# Altium schematic sheet uc2B.SchDoc: Microcontroller 2 (Part B)
size A4; Author: Marcel Hellwig; Organization: Hamburg Bit-Bots; Address1: Vogt-Kölln-Str. 30; Address2: 22527 Hamburg; Address3: Germany; Address4: www.bit-bots.de; DocumentNumber: 8; Revision: A; SheetNumber: 8; SheetTotal: 16; EMail: info@bit-bots.de
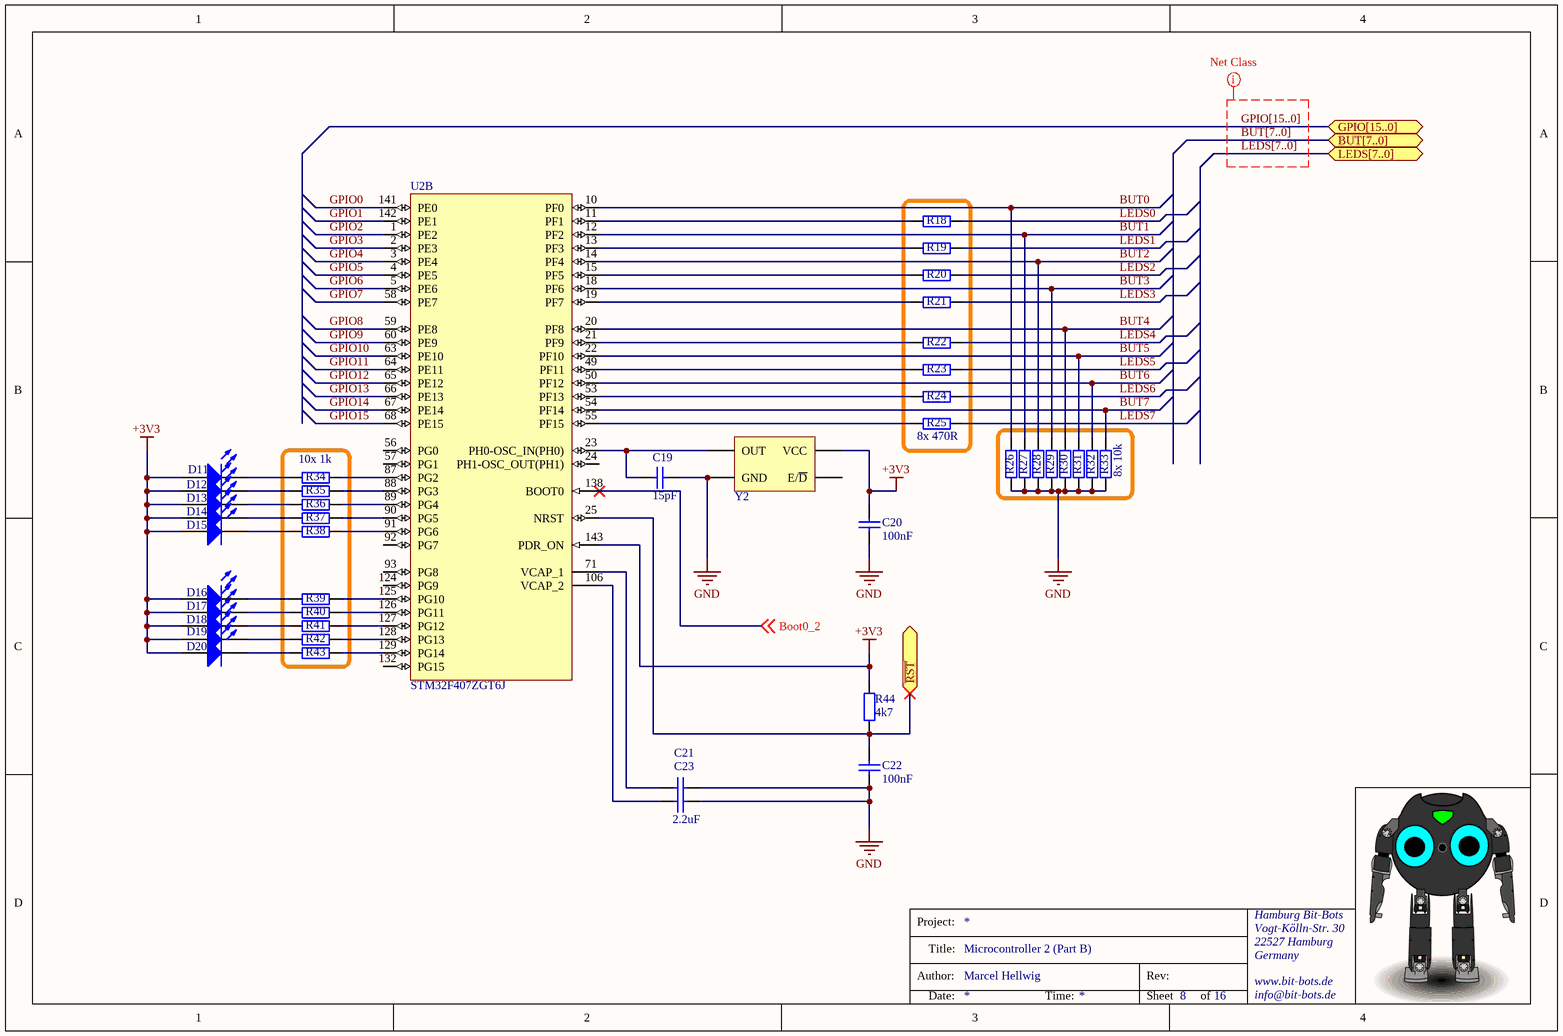
[diagram p0: uc2B.SchDoc]

## Parts
C19  15pF  [C2012]
C20  100nF  [C2012]
C21  2.2uF  [C2012]  (value not drawn)
C22  100nF  [C2012]
C23  2.2uF  [C2012]
D11  Green  [MLCC2]  (value not drawn)
D12  Green  [MLCC2]  (value not drawn)
D13  Green  [MLCC2]  (value not drawn)
D14  Green  [MLCC2]  (value not drawn)
D15  Green  [MLCC2]  (value not drawn)
D16  Green  [MLCC2]  (value not drawn)
D17  Green  [MLCC2]  (value not drawn)
D18  Green  [MLCC2]  (value not drawn)
D19  Green  [MLCC2]  (value not drawn)
D20  Green  [MLCC2]  (value not drawn)
R18  470R  [R2012]  (value not drawn)
R19  470R  [R2012]  (value not drawn)
R20  470R  [R2012]  (value not drawn)
R21  470R  [R2012]  (value not drawn)
R22  470R  [R2012]  (value not drawn)
R23  470R  [R2012]  (value not drawn)
R24  470R  [R2012]  (value not drawn)
R25  470R  [R2012]  (value not drawn)
R26  10k  [R2012]  (value not drawn)
R27  10k  [R2012]  (value not drawn)
R28  10k  [R2012]  (value not drawn)
R29  10k  [R2012]  (value not drawn)
R30  10k  [R2012]  (value not drawn)
R31  10k  [R2012]  (value not drawn)
R32  10k  [R2012]  (value not drawn)
R33  10k  [R2012]  (value not drawn)
R34  1k  [R2012]  (value not drawn)
R35  1k  [R2012]  (value not drawn)
R36  1k  [R2012]  (value not drawn)
R37  1k  [R2012]  (value not drawn)
R38  1k  [R2012]  (value not drawn)
R39  1k  [R2012]  (value not drawn)
R40  1k  [R2012]  (value not drawn)
R41  1k  [R2012]  (value not drawn)
R42  1k  [R2012]  (value not drawn)
R43  1k  [R2012]  (value not drawn)
R44  4k7  [R2012]
U2  STM32F407ZGT6J  [STM-LQFP144_M]  (part B of 3)
Y2  FXO-HC736R-16  [FXO-HC73]  (value not drawn)

## Blocks framed on the sheet
8x 470R: R18-R25
10x 1k: R34-R43
8x 10k: R26-R33

## Ports
BUT[7..0] (bidir), GPIO[15..0] (bidir), LEDS[7..0] (bidir), ~{RST}

## Nets
+3V3: C20.1 D11.1(A) D12.1(A) D13.1(A) D14.1(A) D15.1(A) D16.1(A) D17.1(A) D18.1(A) D19.1(A) D20.1(A) R44.1 U2.143(PDR_ON) Y2.4(VCC)
GND: C19.1 C20.2 C21.2 C22.1 C23.2 R26.2 R27.2 R28.2 R29.2 R30.2 R31.2 R32.2 R33.2 Y2.2(GND)
~{RST}: C22.2 R44.2 U2.25(NRST) ; port ~{RST}
Boot0_2: U2.138(BOOT0) ; off-sheet Boot0_2
BUT0: R26.1 U2.10(PF0)
BUT1: R27.1 U2.12(PF2)
BUT2: R28.1 U2.14(PF4)
BUT3: R29.1 U2.18(PF6)
BUT4: R30.1 U2.20(PF8)
BUT5: R31.1 U2.22(PF10)
BUT6: R32.1 U2.50(PF12)
BUT7: R33.1 U2.54(PF14)
GPIO0: U2.141(PE0)
GPIO1: U2.142(PE1)
GPIO2: U2.1(PE2)
GPIO3: U2.2(PE3)
GPIO4: U2.3(PE4)
GPIO5: U2.4(PE5)
GPIO6: U2.5(PE6)
GPIO7: U2.58(PE7)
GPIO8: U2.59(PE8)
GPIO9: U2.60(PE9)
GPIO10: U2.63(PE10)
GPIO11: U2.64(PE11)
GPIO12: U2.65(PE12)
GPIO13: U2.66(PE13)
GPIO14: U2.67(PE14)
GPIO15: U2.68(PE15)
LEDS0: R18.2
LEDS1: R19.2
LEDS2: R20.2
LEDS3: R21.2
LEDS4: R22.2
LEDS5: R23.2
LEDS6: R24.2
LEDS7: R25.2
NetC19_2: C19.2 U2.23(PH0-OSC_IN(PH0)) Y2.3(OUT)
NetC21_1: C21.1 U2.71(VCAP_1)
NetC23_1: C23.1 U2.106(VCAP_2)
NetD11_2: D11.2(K) R34.2
NetD12_2: D12.2(K) R35.2
NetD13_2: D13.2(K) R36.2
NetD14_2: D14.2(K) R37.2
NetD15_2: D15.2(K) R38.2
NetD16_2: D16.2(K) R39.2
NetD17_2: D17.2(K) R40.2
NetD18_2: D18.2(K) R41.2
NetD19_2: D19.2(K) R42.2
NetD20_2: D20.2(K) R43.2
NetR18_1: R18.1 U2.11(PF1)
NetR19_1: R19.1 U2.13(PF3)
NetR20_1: R20.1 U2.15(PF5)
NetR21_1: R21.1 U2.19(PF7)
NetR22_1: R22.1 U2.21(PF9)
NetR23_1: R23.1 U2.49(PF11)
NetR24_1: R24.1 U2.53(PF13)
NetR25_1: R25.1 U2.55(PF15)
NetR34_1: R34.1 U2.87(PG2)
NetR35_1: R35.1 U2.88(PG3)
NetR36_1: R36.1 U2.89(PG4)
NetR37_1: R37.1 U2.90(PG5)
NetR38_1: R38.1 U2.91(PG6)
NetR39_1: R39.1 U2.125(PG10)
NetR40_1: R40.1 U2.126(PG11)
NetR41_1: R41.1 U2.127(PG12)
NetR42_1: R42.1 U2.128(PG13)
NetR43_1: R43.1 U2.129(PG14)

Not connected (* = marked no-connect by the designer): U2 24(PH1-OSC_OUT(PH1)) 56(PG0) 57(PG1) 92(PG7) 93(PG8) 124(PG9) 132(PG15); Y2 1(E/~{D})

## Buses and harness runs
bus BUT[7..0] = port BUT[7..0]
bus GPIO[15..0] = port GPIO[15..0]
bus LEDS[7..0] = port LEDS[7..0]

## Layout directives
net class GPIO: BUT[7..0], GPIO[15..0], LEDS[7..0]

## Notes on the sheet
- Project:
- Author:
- Title:
- Rev:
- Date:
- Time:
- Sheet
- of

## Library data of the parts
C19 = Cap: Capacitor; Manufacturer: MULTICOMP; Manufacturer Part Number: MC0805N150J500CT; Produktpalette: Baureihe MC; Kapazität: 15; Kapazitätstoleranz: ±5%; Dielektrikum: C0G / NP0; Nennspannung: 50; Keramikkondensatorgehäuse: 0805 [Metrisch 2012]; Betriebstemperatur, min.: -55; Betriebstemperatur, max.: 125; Verpackung: Gurtabschnitt; SVHC: No SVHC (17-Dec-2014); Betriebstemperatur: -55°C bis +125; Kondensatoranschlüsse: SMD<!--FANDB--><div class="features-and-benefits-container"></div>; Published: 8-Jun-2000; LatestRevisionDate: 17-Jul-2002; LatestRevisionNote: Re-released for DXP Platform.; PackageReference: RAD-0.3; Publisher: Altium Limited; PackageDescription: Radial Cap, Thru-Hole; 2 Leads; 0.3 in Pin Spacing; Value: 15pF; Supplier 1: Farnell; Supplier Part Number 1: 1759193; RoHS: YES; Stock 1: 38433; Pricing 1: 10=0,021, 100=0,017, 500=0,014, 1000=0,012, 2000=0,009 (EUR); MSL: -; Bauform: 0805 [Metrisch 2012]; Kapazitätstoleranz ±: ±5%; ComponentLink1URL: http://www.farnell.com/datasheets/1870456.pdf; ComponentLink1Description: http://www.farnell.com/datasheets/1870456.pdf
C20 = Cap: Capacitor; Published: 8-Jun-2000; LatestRevisionDate: 17-Jul-2002; LatestRevisionNote: Re-released for DXP Platform.; PackageReference: RAD-0.3; Publisher: Altium Limited; PackageDescription: Radial Cap, Thru-Hole; 2 Leads; 0.3 in Pin Spacing; Value: 100nF; Supplier 1: Farnell; Supplier Part Number 1: 1759265
C21 C23 = Cap: Capacitor; Manufacturer: MULTICOMP; Manufacturer Part Number: MC0805B225K250CT; Produktpalette: Baureihe MC; Kapazität: 2.2; Kapazitätstoleranz: ±10%; Dielektrikum: X7; Nennspannung: 25; Keramikkondensatorgehäuse: 0805 [Metrisch 2012]; Betriebstemperatur, min.: -55; Betriebstemperatur, max.: 125; Verpackung: Gurtabschnitt; Kondensatoranschlüsse: SMD<!--FANDB--><div class="features-and-benefits-container"></div>; Published: 8-Jun-2000; LatestRevisionDate: 17-Jul-2002; LatestRevisionNote: Re-released for DXP Platform.; PackageReference: RAD-0.3; Publisher: Altium Limited; PackageDescription: Radial Cap, Thru-Hole; 2 Leads; 0.3 in Pin Spacing; Value: 2.2uF; Supplier 1: Farnell; Supplier Part Number 1: 2320829; RoHS: YES; Stock 1: 13870; Pricing 1: 10=0,101, 100=0,084, 500=0,071, 1000=0,058, 1500=0,046 (EUR); MSL: MSL 1 - unbegrenzt; Bauform: 0805 [Metrisch 2012]; Kapazitätstoleranz ±: ±10%; ComponentLink1URL: http://www.farnell.com/datasheets/1870456.pdf; ComponentLink1Description: http://www.farnell.com/datasheets/1870456.pdf
C22 = Cap: Capacitor; Manufacturer: MULTICOMP; Manufacturer Part Number: MC0805B104K500CT; Produktpalette: Baureihe MC; Kapazität: 0.1; Kapazitätstoleranz: ±10%; Dielektrikum: X7; Nennspannung: 50; Keramikkondensatorgehäuse: 0805 [Metrisch 2012]; Betriebstemperatur, min.: -55; Betriebstemperatur, max.: 125; Verpackung: Gurtabschnitt; SVHC: No SVHC (17-Dec-2014); Betriebstemperatur: -55°C bis +125; Kondensatoranschlüsse: SMD<!--FANDB--><div class="features-and-benefits-container"></div>; Published: 8-Jun-2000; LatestRevisionDate: 17-Jul-2002; LatestRevisionNote: Re-released for DXP Platform.; PackageReference: RAD-0.3; Publisher: Altium Limited; PackageDescription: Radial Cap, Thru-Hole; 2 Leads; 0.3 in Pin Spacing; Value: 100nF; Supplier 1: Farnell; Supplier Part Number 1: 1759265; RoHS: YES; Stock 1: 692587; Pricing 1: 10=0,013, 100=0,011, 500=0,009, 1000=0,008, 2000=0,006 (EUR); MSL: -; Bauform: 0805 [Metrisch 2012]; Kapazitätstoleranz ±: ±10%; ComponentLink1URL: http://www.farnell.com/datasheets/1870456.pdf; ComponentLink1Description: http://www.farnell.com/datasheets/1870456.pdf
D11-D20 = LED0: Typical INFRARED GaAs LED; Manufacturer: VISHAY; Manufacturer Part Number: VLMC3100-GS08; Leuchtengröße: 2.4; LED-Farbe: Grün; Lichtstärke: 1.6; Abstrahlwinkel: 120°; Durchlassstrom If: 2; Durchlassspannung: 1.9; LED-Montage: Oberflächenmontage; Linsenform: Rund; Wellenlänge, typ.: 575; Verpackung: Gurtabschnitt; SVHC: No SVHC (16-Jun-2014); Betriebstemperatur: -40°C bis +100; Betriebstemperatur, max.: 100; Betriebstemperatur, min.: -40; LED-Typ: Standard; LED/Lampen Größe: PLCC-2; Montage: SMD; Sperrspannung: 6; Spitzenwellenlänge: 565; Winkel halber Empfindlichkeit ±: 60; Published: 8-Jun-2000; LatestRevisionDate: 08-Jul-2005; LatestRevisionNote: Mech Layer 1 removed.; PackageReference: LED-0; Publisher: Altium Limited; PackageDescription: LED; 2 Leads; Supplier 1: Farnell; Supplier Part Number 1: 1659076; RoHS: YES; Stock 1: 12975; Pricing 1: 5=0,105, 25=0,0998, 100=0,0952, 250=0,0917, 500=0,0865, 2000=0,0771, 4000=0,0717, 20000=0,0689 (EUR); MSL: MSL 2A - 4 Wochen; Anzahl der Pins: 2; Dominante Wellenlänge: 575; Durchlassspannung Vf max.: 2.4; Durchlassstrom If, max.: 2; Lichtstärke, typ.: 1.6; ComponentLink1URL: http://www.farnell.com/datasheets/1698102.pdf; ComponentLink1Description: http://www.farnell.com/datasheets/1698102.pdf
R18-R25 = Res2: Resistor; Manufacturer: MULTICOMP; Manufacturer Part Number: MCSR08X4700FTL; Produktpalette: Baureihe MCSR 08; Widerstand: 470; Nennleistung: 125; Widerstandstoleranz: ±1%; Bauform: 0805 [Metrisch 2012]; Widerstandselement: Keramik; Temperaturkoeffizient: ±100; Nennspannung: 150; Verpackung: Gurtabschnitt; SVHC: No SVHC (17-Dec-2014); Widerstandsmontage: Oberflächenmontage<!--FANDB--><div class="features-and-benefits-container"></div>; Published: 8-Jun-2000; LatestRevisionDate: 17-Jul-2002; LatestRevisionNote: Re-released for DXP Platform.; PackageReference: AXIAL-0.4; Publisher: Altium Limited; PackageDescription: Axial Device, Thru-Hole; 2 Leads; 0.4 in Pin Spacing; Value: 470R; Supplier 1: Farnell; Supplier Part Number 1: 2074468; RoHS: YES; Stock 1: 1200; Pricing 1: 100=0,011, 500=0,01, 1000=0,009 (EUR); MSL: -; ComponentLink1URL: http://www.farnell.com/datasheets/1716717.pdf; ComponentLink1Description: http://www.farnell.com/datasheets/1716717.pdf
R26-R33 = Res2: Resistor; Manufacturer: MULTICOMP; Manufacturer Part Number: MC01W0805110K; Produktpalette: Baureihe MC; Widerstand: 10; Nennleistung: 100; Widerstandstoleranz: ±1%; Bauform: 0805 [Metrisch 2012]; Widerstandselement: Dickschicht; Temperaturkoeffizient: ±100; Nennspannung: 150; Verpackung: Gurtabschnitt; SVHC: No SVHC (17-Dec-2014); Anzahl der Pins: 2; Außenbreite: 1.25; Außentiefe: 0.55; Bandbreite: 8; Baureihe: MC; Betriebstemperatur: -55°C bis +155; Betriebstemperatur, max.: 155; Betriebstemperatur, min.: -55; Menge pro Rolle: 5000; Toleranz (+): 1%; Widerstandsmontage: Oberflächenmontage<!--FANDB--><div class="features-and-benefits-container"></div>; Published: 8-Jun-2000; LatestRevisionDate: 17-Jul-2002; LatestRevisionNote: Re-released for DXP Platform.; PackageReference: AXIAL-0.4; Publisher: Altium Limited; PackageDescription: Axial Device, Thru-Hole; 2 Leads; 0.4 in Pin Spacing; Value: 10k; Supplier 1: Farnell; Supplier Part Number 1: 9332391; RoHS: Y-EX; Stock 1: 4370; Pricing 1: 50=0,038, 250=0,031, 1000=0,022, 5000=0,014, 15000=0,009 (EUR); MSL: -; Außenlänge/-höhe: 2; Nennspannung, V DC: 150; Temperaturkoeffizient, +: 100; Temperaturkoeffizient, -: 100; Toleranz (-): 1%; ComponentLink1URL: http://www.farnell.com/datasheets/1729047.pdf; ComponentLink1Description: http://www.farnell.com/datasheets/1729047.pdf; ComponentLink2URL: http://www.farnell.com/cad/1561156.zip; ComponentLink2Description: http://www.farnell.com/cad/1561156.zip
R34-R43 = Res2: Resistor; Manufacturer: MULTICOMP; Manufacturer Part Number: MC01W0805110K; Published: 8-Jun-2000; LatestRevisionDate: 17-Jul-2002; LatestRevisionNote: Re-released for DXP Platform.; PackageReference: AXIAL-0.4; Publisher: Altium Limited; PackageDescription: Axial Device, Thru-Hole; 2 Leads; 0.4 in Pin Spacing; Value: 1k; Supplier 1: Farnell; Supplier Part Number 1: 9332391; RoHS: Y-EX; Stock 1: 4370; Pricing 1: 50=0,038, 250=0,031, 1000=0,022, 5000=0,014, 15000=0,009 (EUR); ComponentLink1URL: http://www.farnell.com/datasheets/1729047.pdf; ComponentLink1Description: http://www.farnell.com/datasheets/1729047.pdf; ComponentLink2URL: http://www.farnell.com/cad/1561156.zip; ComponentLink2Description: http://www.farnell.com/cad/1561156.zip
R44 = Res2: Resistor; Manufacturer: MULTICOMP; Manufacturer Part Number: MC01W080514K7; Produktpalette: Baureihe MC; Widerstand: 4.7; Nennleistung: 100; Widerstandstoleranz: ±1%; Bauform: 0805 [Metrisch 2012]; Widerstandselement: Dickschicht; Temperaturkoeffizient: ±100; Nennspannung: 150; Verpackung: Gurtabschnitt; SVHC: No SVHC (17-Dec-2014); Anzahl der Pins: 2; Außenbreite: 1.25; Außentiefe: 0.55; Bandbreite: 8; Baureihe: MC; Betriebstemperatur: -55°C bis +155; Betriebstemperatur, max.: 155; Betriebstemperatur, min.: -55; Menge pro Rolle: 5000; Toleranz (+): 1%; Widerstandsmontage: Oberflächenmontage<!--FANDB--><div class="features-and-benefits-container"></div>; Published: 8-Jun-2000; LatestRevisionDate: 17-Jul-2002; LatestRevisionNote: Re-released for DXP Platform.; PackageReference: AXIAL-0.4; Publisher: Altium Limited; PackageDescription: Axial Device, Thru-Hole; 2 Leads; 0.4 in Pin Spacing; Value: 4k7; Supplier 1: Farnell; Supplier Part Number 1: 9333266; RoHS: Y-EX; Stock 1: 190984; Pricing 1: 50=0,038, 250=0,031, 1000=0,022, 5000=0,014, 15000=0,009 (EUR); MSL: -; Außenlänge/-höhe: 2; Nennspannung, V DC: 150; Temperaturkoeffizient, +: 100; Temperaturkoeffizient, -: 100; Toleranz (-): 1%; ComponentLink1URL: http://www.farnell.com/datasheets/1729047.pdf; ComponentLink1Description: http://www.farnell.com/datasheets/1729047.pdf; ComponentLink2URL: http://www.farnell.com/cad/1561170.zip; ComponentLink2Description: http://www.farnell.com/cad/1561170.zip
U2 = CMP-0243-00063-2: ARM Cortex-M4 32-bit MCU+FPU, 210 DMIPS, 1024 kB Flash, 192 kB Internal RAM, 114 I/Os, 144-pin LQFP, -40 to 85 degC, Tray; Manufacturer: STMicroelectronics; I/Os (High Current): 114; D/A Converter: 2x12-bit; Internal RAM Size (kB): 192; Operating Frequency(F) (Processor speed) (MHz): 168; Supply Voltage(Vcc) max (V): 3.6; Supply Voltage(Vcc) min (V): 1.8; FLASH Size (Prog) (kB): 1024; ComponentLink3Description: Package Specification; PackageVersion: Rev. 4, 06/2013; PartNumber: STM32F407ZGT6J; ComponentLink3URL: http://www.st.com/st-web-ui/static/active/en/resource/technical/document/datasheet/DM00037051.pdf; PackageReference: LQFP144; ComponentLink2URL: http://www.st.com/st-web-ui/static/active/en/resource/technical/document/datasheet/DM00037051.pdf; ComponentLink2Description: Datasheet; ComponentLink1Description: Manufacturer URL; Mounting Technology: Surface Mount; Core: ARM Cortex-M4; PackageDescription: 144-Pin Low Profile Quad Flat Package, 20 x 20 mm Body, 0.5 mm Pitch; Packing: Tray; ComponentLink1URL: http://www.st.com/web/en/home.html; DatasheetVersion: Rev. 4; PartId: 1; Supplier 1: Farnell; Supplier Part Number 1: 2333299
Y2 = Oszillator: Oscillator with Enable Input; Supplier 1: Farnell; Supplier Part Number 1: 1640997